# Altium schematic sheet FMU_Power_FMU_REV_2A.SchDoc: Cube Yellow and Cube Orange
size A3; Date: 18/08/2014 1:53:18 PM; Author: PR; DrawnBy: Philip Rowse; Engineer: Philip Rowse; Organization: ProfiCNC/Hex; Address3: VIC; Address4: Australia; Revision: A; SheetNumber: 3; SheetTotal: 10
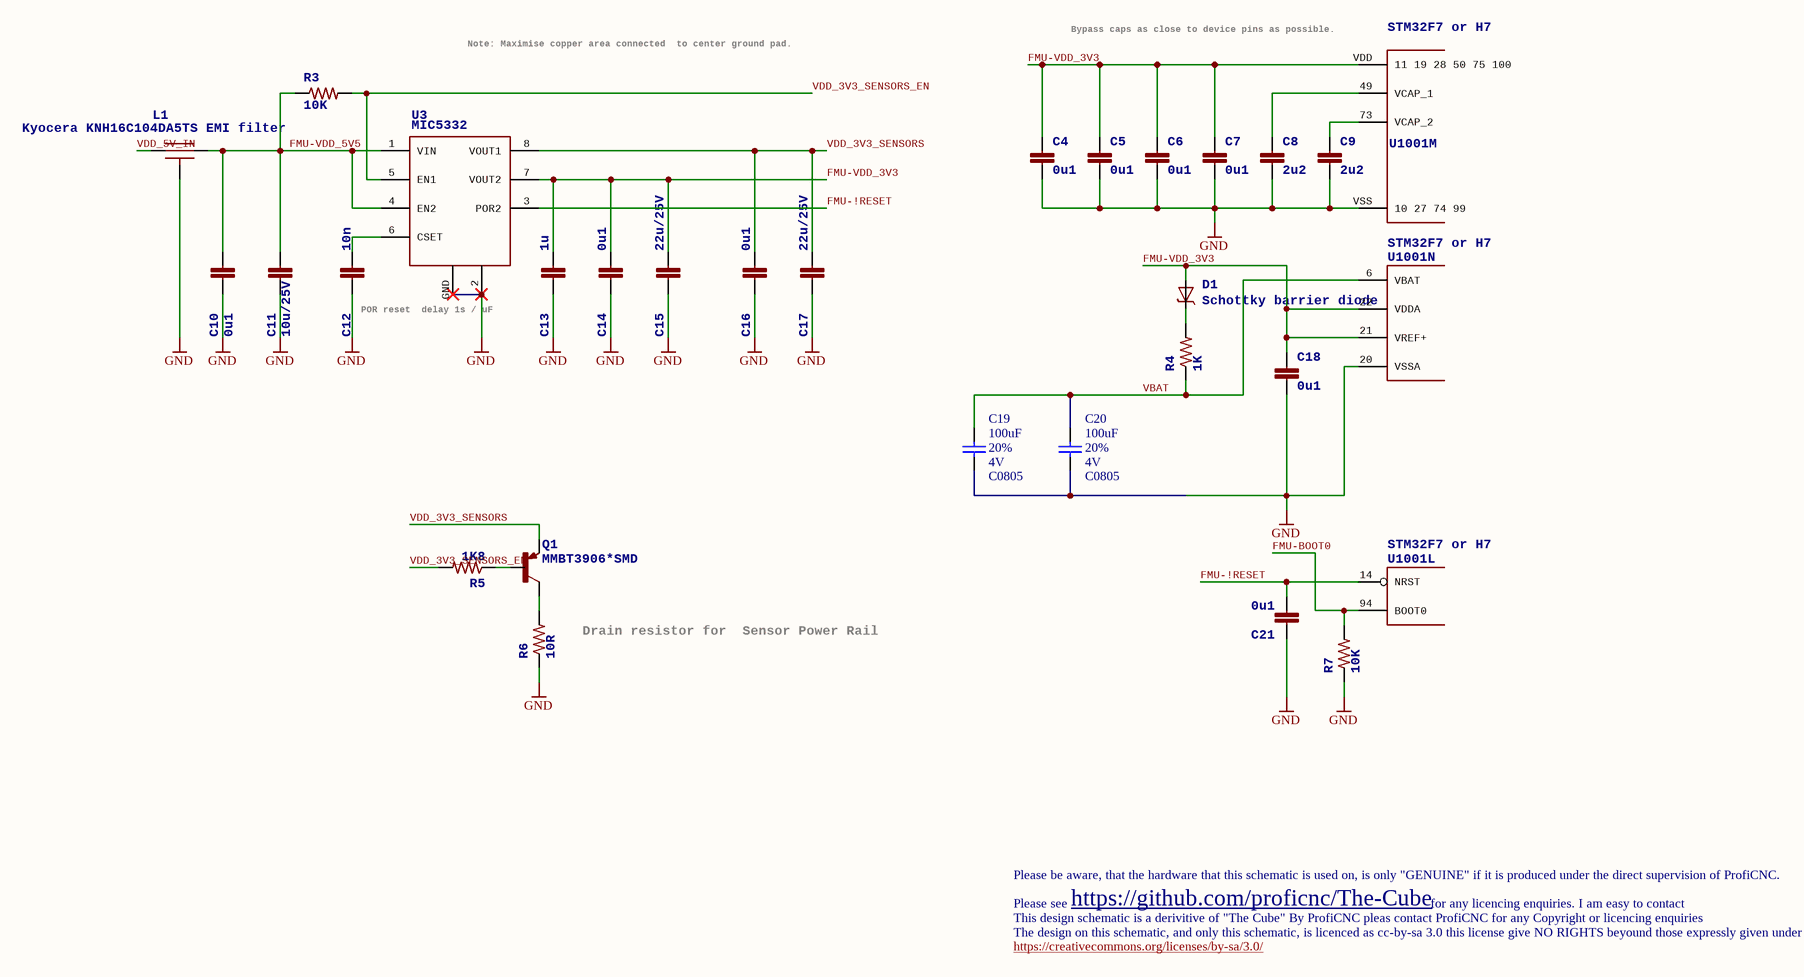
[diagram p0: FMU_Power_FMU_REV_2A.SchDoc]

## Parts
C4  0u1  [0402-CAP]
C5  0u1  [0402-CAP]
C6  0u1  [0402-CAP]
C7  0u1  [0402-CAP]
C8  2u2  [0603-CAP]
C9  2u2  [0603-CAP]
C10  0u1  [0402-CAP]
C11  10u/25V  [0805-CAP]
C12  10n  [0402-CAP]
C13  1u  [0603-CAP]
C14  0u1  [0402-CAP]
C15  22u/25V  [0805-CAP]
C16  0u1  [0402-CAP]
C17  22u/25V  [0805-CAP]
C18  0u1  [0402-CAP]
C19  value 100uF  Tolerance: 20%  Voltage: 4V  [C0805]  (hidden comment: GRM21BR60G107ME15L)
C20  value 100uF  Tolerance: 20%  Voltage: 4V  [C0805]  (hidden comment: GRM21BR60G107ME15L)
C21  0u1  [0402-CAP]
D1  Schottky barrier diode  [SOD323]
L1  Kyocera KNH16C104DA5TS EMI filter  [KYOCERA-KNH16-DA]
Q1  MMBT3906*SMD  [SOT23-BEC]
R3  10K  [0402-RES]
R4  1K  [0402-RES]
R5  1K8  [0402-RES]
R6  10R  [0603-RES]
R7  10K  [0402-RES]
U3  MIC5332  [MLF-8-EPAD]
U1001  STM32F7 or H7  [TQFP100]  (parts L,M,N of 14)

## Nets
GND: C4.P$2 C5.P$2 C6.P$2 C7.P$2 C8.P$2 C9.P$2 C10.P$2 C11.P$2 C12.P$1 C13.P$2 C14.P$2 C15.P$2 C16.P$2 C17.P$2 C18.P$2 C19.1 C20.1 C21.P$1 L1.GND R6.1 R7.P$1 U3.2(GND) U3.GND U1001.20(VSSA) U1001.VSS(10_27_74_99)
FMU-!RESET: C21.P$2 U3.3(POR2) U1001.14(NRST)
FMU-BOOT0: R7.P$2 U1001.94(BOOT0)
FMU-VDD_3V3: C4.P$1 C5.P$1 C6.P$1 C7.P$1 C13.P$1 C14.P$1 C15.P$1 C18.P$1 D1.A U3.7(VOUT2) U1001.21(VREF+) U1001.22(VDDA) U1001.VDD(11_19_28_50_75_100)
FMU-VDD_5V5: C10.P$1 C11.P$1 L1.P$2 R3.P$1 U3.1(VIN) U3.4(EN2)
VBAT: C19.2 C20.2 R4.P$1 U1001.6(VBAT)
VDD_3V3_SENSORS: C16.P$1 C17.P$1 Q1.E U3.8(VOUT1)
VDD_3V3_SENSORS_EN: R3.P$2 R5.P$2 U3.5(EN1)
VDD_5V_IN: L1.P$1
NetC8_P$1: C8.P$1 U1001.49(VCAP_1)
NetC9_P$1: C9.P$1 U1001.73(VCAP_2)
NetC12_P$2: C12.P$2 U3.6(CSET)
NetD1_C: D1.C R4.P$2
NetQ1_B: Q1.B R5.P$1
NetQ1_C: Q1.C R6.2

## Notes on the sheet
- Note: Maximise copper area connected
  to center ground pad.
- Bypass caps as close to device pins as possible.
- POR reset
  delay 1s / uF
- Drain resistor for
  Sensor Power Rail
- Please be aware, that the hardware that this schematic is used on, is only "GENUINE" if it is produced under the direct supervision of ProfiCNC.
- The design on this schematic, and only this schematic, is licenced as cc-by-sa 3.0 this license give NO RIGHTS beyound those expressly given under the terms of this license.
- This design schematic is a derivitive of "The Cube" By ProfiCNC pleas contact ProfiCNC for any Copyright or licencing enquiries
- https://creativecommons.org/licenses/by-sa/3.0/
- Please see
- https://github.com/proficnc/The-Cube
- for any licencing enquiries. I am easy to contact
- Drawn By:
- Verified for production by:
- Approved for release:
- Title
- Size:
- Date:
- A
- Number:
- Time:
- Revision:
- Sheet
- of
- File:

## Library data of the parts
C4-C7 C10 C14 C16 C18 C21 = CAP0402: CAP CER 0.1UF 16V Y5V 0402; Value: 0u1
C8 C9 = CAP0603: CAP CER 2.2UF 16V 10% X6S 0603; Value: 2u2
C11 = CAP0805: CAP CER 10UF 25V 10% X5R 0805; Value: 10u/25
C12 = CAP0402: CAP CER 10000PF 16V 10% X7R 0402; Value: 10n
C13 = CAP0603: CAP CER 1UF 16V Y5V 0603; Value: 1u
C15 C17 = CAP0805: CAP CER 22UF 25V 20% X5R 0805; Value: 22u/25V
C19 C20 = Capacitor
D1 = DIODE-SCHOTTKY_SOD323: DIODE SCHOTTKY 30V 0.03A SOD323; Value: 30V
L1 = KNH16C104DA5TS: FILTER CAP 0.1UF 2A 25V 0603; Value: 0u1
Q1 = MMBT3906*SMD: TRANSISTOR SWITCHING PNP SOT-23
R3 R7 = RESISTOR0402-RES: RES 10K OHM 1/16W 1% 0402 SMD; Value: 10K
R4 = RESISTOR0402-RES: RES 1K OHM 1/16W 1% 0402; Value: 1K
R5 = RESISTOR0402-RES: RES 1.8K OHM 1/16W 1% 0402; Value: 1K8
R6 = RESISTOR0603-RES: RES 10 OHM 1/10W 5% 0603; Value: 10R
U3 = MIC5332: IC REG LDO 3.3V 0.3A 8TMLF; Value: 3.3V
U1001 = STM32F4X7VX: REV 3 Silicon or later IC MCU ARM 2MB FLASH 100LQFP